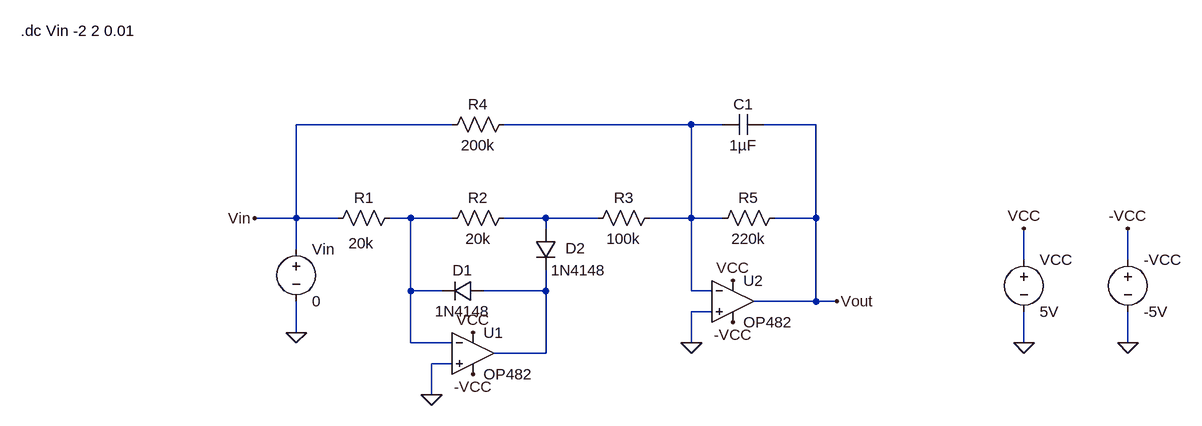
[diagram p0: schematic Etaj4_dc_sweep.asc]
Etaj4_dc_sweep.asc, the LTspice schematic file:
Version 4
SHEET 1 1280 808
WIRE 160 336 -80 336
WIRE 528 336 240 336
WIRE 576 336 528 336
WIRE 720 336 640 336
WIRE -80 480 -80 336
WIRE -80 480 -144 480
WIRE -16 480 -80 480
WIRE 96 480 64 480
WIRE 160 480 96 480
WIRE 304 480 240 480
WIRE 384 480 304 480
WIRE 528 480 528 336
WIRE 528 480 464 480
WIRE 576 480 528 480
WIRE 720 480 720 336
WIRE 720 480 656 480
WIRE 304 496 304 480
WIRE -80 528 -80 480
WIRE 1040 544 1040 496
WIRE 1200 544 1200 496
WIRE 96 592 96 480
WIRE 144 592 96 592
WIRE 304 592 304 560
WIRE 304 592 208 592
WIRE 528 592 528 480
WIRE 560 592 528 592
WIRE 720 608 720 480
WIRE 720 608 624 608
WIRE 752 608 720 608
WIRE 560 624 528 624
WIRE -80 656 -80 608
WIRE 96 672 96 592
WIRE 160 672 96 672
WIRE 528 672 528 624
WIRE 1040 672 1040 624
WIRE 1200 672 1200 624
WIRE 304 688 304 592
WIRE 304 688 224 688
WIRE 160 704 128 704
WIRE 128 752 128 704
FLAG -80 656 0
FLAG 128 752 0
FLAG 528 672 0
FLAG 1040 672 0
FLAG 1200 672 0
FLAG 192 656 VCC
FLAG 592 576 VCC
FLAG 1040 496 VCC
FLAG 192 720 -VCC
FLAG 592 640 -VCC
FLAG 1200 496 -VCC
FLAG 752 608 Vout
FLAG -144 480 Vin
SYMBOL OP482 192 624 R0
SYMATTR InstName U1
SYMBOL Voltage -80 512 R0
SYMATTR InstName Vin
SYMATTR Value 0
SYMBOL Res 80 464 R90
WINDOW 0 0 56 VBottom 2
WINDOW 3 39 60 VTop 2
SYMATTR InstName R1
SYMATTR Value 20k
SYMBOL diode 208 576 R90
WINDOW 0 0 32 VBottom 2
WINDOW 3 32 32 VTop 2
SYMATTR InstName D1
SYMATTR Value 1N4148
SYMBOL diode 288 496 R0
WINDOW 0 46 30 Left 2
SYMATTR InstName D2
SYMATTR Value 1N4148
SYMBOL Res 256 464 R90
WINDOW 0 0 56 VBottom 2
WINDOW 3 32 56 VTop 2
SYMATTR InstName R2
SYMATTR Value 20k
SYMBOL Res 480 464 R90
WINDOW 0 0 56 VBottom 2
WINDOW 3 32 56 VTop 2
SYMATTR InstName R3
SYMATTR Value 100k
SYMBOL OP482 592 544 R0
SYMATTR InstName U2
SYMBOL Res 256 320 R90
WINDOW 0 0 56 VBottom 2
WINDOW 3 32 56 VTop 2
SYMATTR InstName R4
SYMATTR Value 200k
SYMBOL Res 672 464 R90
WINDOW 0 0 56 VBottom 2
WINDOW 3 32 56 VTop 2
SYMATTR InstName R5
SYMATTR Value 220k
SYMBOL Cap 640 320 R90
WINDOW 0 0 32 VBottom 2
WINDOW 3 32 32 VTop 2
SYMATTR InstName C1
SYMATTR Value 1µF
SYMBOL Voltage 1040 528 R0
SYMATTR InstName VCC
SYMATTR Value 5V
SYMBOL Voltage 1200 528 R0
SYMATTR InstName -VCC
SYMATTR Value -5V
TEXT -504 192 Left 2 !.dc Vin -2 2 0.01

The netlist it stands for:
* Etaj4_dc_sweep.asc
* U1: OP482 (symbol OP482 not available, pins judged from their places): In+=0 In-=N002 V+=VCC V-=-VCC OUT=N004
Vin Vin 0 0
R1 N002 Vin 20k
D1 N004 N002 1N4148
D2 N003 N004 1N4148
R2 N003 N002 20k
R3 N001 N003 100k
* U2: OP482 (symbol OP482 not available, pins judged from their places): In+=0 In-=N001 V+=VCC V-=-VCC OUT=Vout
R4 N001 Vin 200k
R5 Vout N001 220k
C1 Vout N001 1µF
VCC VCC 0 5V
V§-VCC -VCC 0 -5V
.model D D
.lib standard.dio
.dc Vin -2 2 0.01
.backanno
.end